# EAGLE design sensorstation_ok4 (EAGLE 6.2)
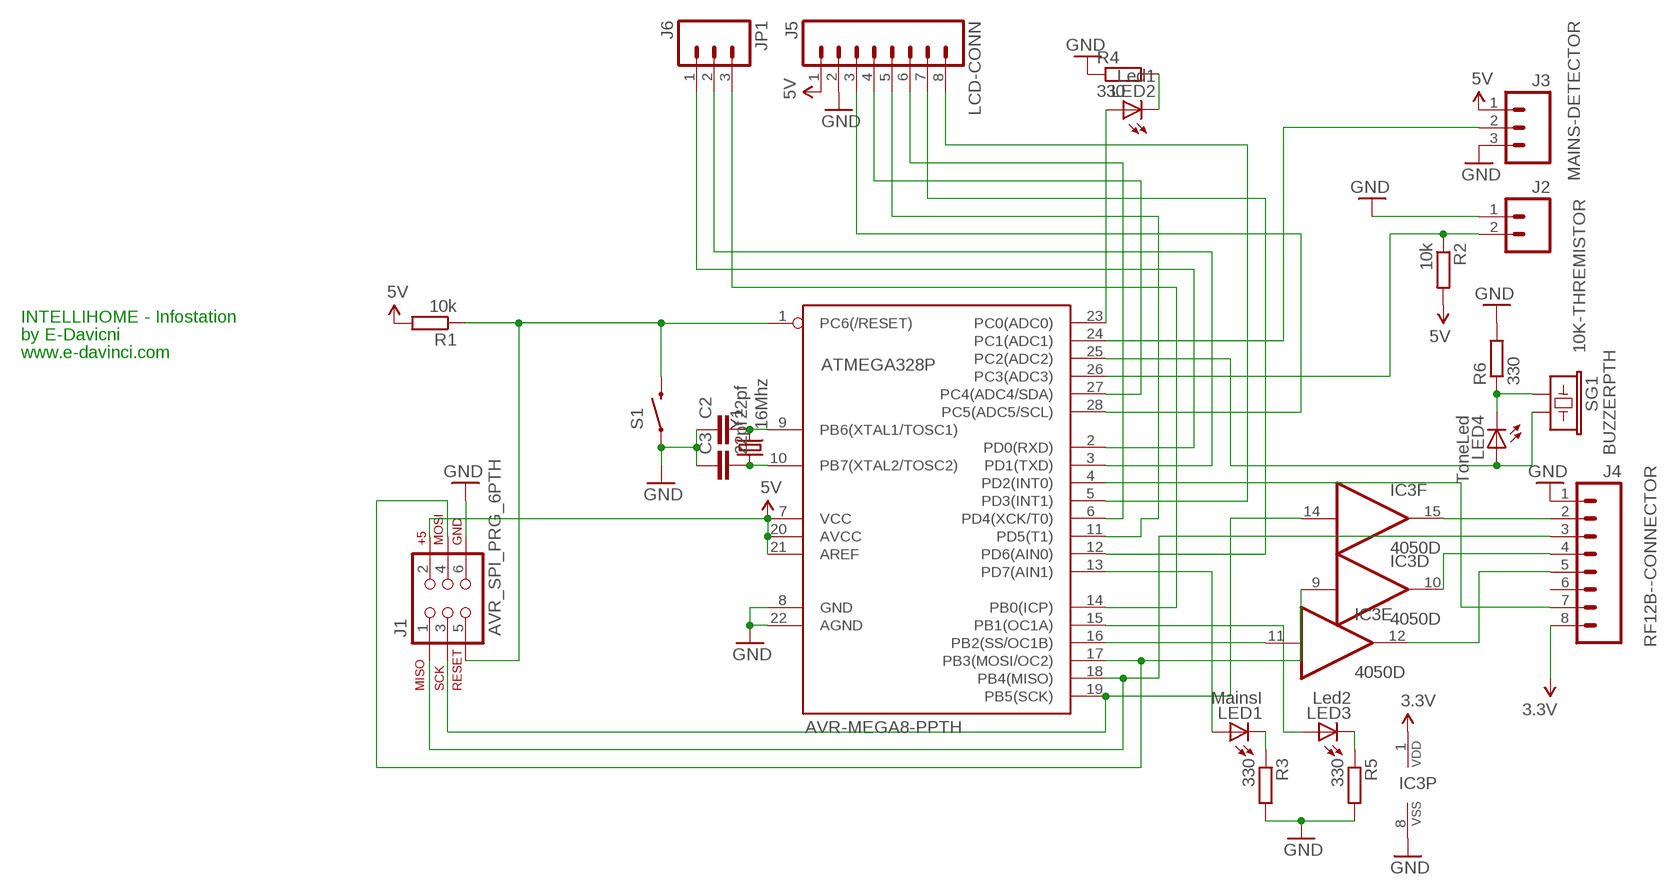
[diagram p0: schematic, sheet 1]

## Parts
10K-THREMISTOR  J2  M02PTH  [1X02]
ATMEGA328P  AVR-MEGA8-PPTH  [DIL28-3]
C2  22pf  CAPPTH  [CAP-PTH-SMALL]
C3  22pf  CAPPTH  [CAP-PTH-SMALL]
IC3  4050D  [SO16]
J1  AVR_SPI_PRG_6PTH  [2X3]
JP1  J6  M03PTH  [1X03]
LCD-CONN  J5  M081X08  [1X08]
LED1  MainsI  LED3MM  [LED3MM]
LED2  Led1  LED3MM  [LED3MM]
LED3  Led2  LED3MM  [LED3MM]
LED4  ToneLed  LED3MM  [LED3MM]
MAINS-DETECTOR  J3  M03PTH  [1X03]
R1  10k  R-EU_0207/2V  [0207/2V]
R2  10k  R-EU_0207/2V  [0207/2V]
R3  330  R-EU_0207/2V  [0207/2V]
R4  330  R-EU_0207/2V  [0207/2V]
R5  330  R-EU_0207/2V  [0207/2V]
R6  330  R-EU_0207/2V  [0207/2V]
RF12B--CONNECTOR  J4  M08LONGPADS  [1X08_LONGPADS]
S1  SWITCH-MOMENTARY-2PTH  [TACTILE-PTH]
SG1  BUZZERPTH  [BUZZER-12MM]
Y1  16Mhz  CRYSTALHC49US  [HC49US]

## Nets
3.3V: IC3.1(P:VDD) RF12B--CONNECTOR.8
5V: ATMEGA328P.7(VCC) ATMEGA328P.20(AVCC) ATMEGA328P.21(AREF) J1.2 LCD-CONN.1 MAINS-DETECTOR.1 R1.2 R2.2
GND: 10K-THREMISTOR.1 ATMEGA328P.8(GND) ATMEGA328P.22(AGND) C2.1 C3.1 IC3.8(P:VSS) J1.6 LCD-CONN.2 MAINS-DETECTOR.3 R3.2 R4.1 R5.2 R6.2 RF12B--CONNECTOR.1 S1.1
N$1: ATMEGA328P.4(PD2(INT0)) RF12B--CONNECTOR.7
N$2: ATMEGA328P.16(PB2(SS/OC1B)) IC3.11(E:I)
N$3: ATMEGA328P.19(PB5(SCK)) IC3.14(F:I) J1.3
N$4: ATMEGA328P.17(PB3(MOSI/OC2)) IC3.9(D:I) J1.4
N$5: IC3.10(D:O) RF12B--CONNECTOR.4
N$6: ATMEGA328P.9(PB6(XTAL1/TOSC1)) C2.2 Y1.2
N$7: ATMEGA328P.10(PB7(XTAL2/TOSC2)) C3.2 Y1.1
N$8: ATMEGA328P.24(PC1(ADC1)) MAINS-DETECTOR.2
N$9: 10K-THREMISTOR.2 ATMEGA328P.26(PC3(ADC3)) R2.1
N$10: LED1.K(C) R3.1
N$11: LED4.K(C) R6.1 SG1.+
N$12: LED2.K(C) R4.2
N$13: LED3.K(C) R5.1
N$14: ATMEGA328P.23(PC0(ADC0)) LED2.A
N$15: ATMEGA328P.15(PB1(OC1A)) LED3.A
N$16: ATMEGA328P.25(PC2(ADC2)) LED4.A SG1.-
N$17: ATMEGA328P.14(PB0(ICP)) JP1.3
N$18: IC3.15(F:O) RF12B--CONNECTOR.2
N$20: IC3.12(E:O) RF12B--CONNECTOR.5
N$22: ATMEGA328P.13(PD7(AIN1)) LED1.A
N$23: ATMEGA328P.18(PB4(MISO)) J1.1 RF12B--CONNECTOR.3
N$24: ATMEGA328P.12(PD6(AIN0)) LCD-CONN.7
N$25: ATMEGA328P.11(PD5(T1)) LCD-CONN.5
N$26: ATMEGA328P.6(PD4(XCK/T0)) LCD-CONN.6
N$27: ATMEGA328P.5(PD3(INT1)) LCD-CONN.8
N$28: ATMEGA328P.3(PD1(TXD)) JP1.2
N$29: ATMEGA328P.2(PD0(RXD)) JP1.1
N$30: ATMEGA328P.27(PC4(ADC4/SDA)) LCD-CONN.4
N$31: ATMEGA328P.28(PC5(ADC5/SCL)) LCD-CONN.3
N$34: ATMEGA328P.1(PC6(/RESET)) J1.5 R1.1 S1.3
Unconnected: IC3.2(A:O) IC3.3(A:I) IC3.4(B:O) IC3.5(B:I) IC3.6(C:O) IC3.7(C:I) RF12B--CONNECTOR.6

## Notes on the sheet
- INTELLIHOME - Infostation
- by E-Davicni
- www.e-davinci.com

## Library data of the parts
10K-THREMISTOR = SparkFun:M02: Header 2 Standard 2-pin 0.1" header. Use with straight break away headers (SKU : PRT-00116), right angle break away headers (PRT-00553), swiss pins (PRT-00743), machine pins (PRT-00117), and female headers (PRT-00115). Molex polarized connector foot print use with SKU : PRT-08233 with associated crimp pins and housings.
ATMEGA328P = SparkFun:AVR-MEGA8-P: MICROCONTROLLER 8 Kbytes FLASH 1 kbytes SRAM 512 bytes EEPROM USART 4-channel 10 bit ADC 2-channel 8 bit ADC
C2 C3 = SparkFun:CAP: Capacitor Standard 0603 ceramic capacitor, and 0.1" leaded capacitor.
IC3 = 40xx:4050: Hex non-inverting BUFFER
J1 = SparkFun:AVR_SPI_PRG_6: AVR ISP 6 Pin This is the reduced ISP connector for AVR programming. Common on Arduino. This footprint will take up less PCB space and can be used with a 10-pin to 6-pin adapter such as SKU: BOB-08508
JP1 MAINS-DETECTOR = SparkFun:M03: Header 3 Standard 3-pin 0.1" header. Use with straight break away headers (SKU : PRT-00116), right angle break away headers (PRT-00553), swiss pins (PRT-00743), machine pins (PRT-00117), and female headers (PRT-00115). Molex polarized connector foot print use with SKU : PRT-08232 with associated crimp pins and housings.
LCD-CONN RF12B--CONNECTOR = SparkFun:M08: Header 8 Standard 8-pin 0.1" header. Use with straight break away headers (SKU : PRT-00116), right angle break away headers (PRT-00553), swiss pins (PRT-00743), machine pins (PRT-00117), and female headers (PRT-00115).
LED1-LED4 = SparkFun:LED: LEDs Standard schematic elements and footprints for 5mm, 3mm, 1206, and 0603 sized LEDs. 5mm - Spark Fun Electronics SKU : COM-00529 (and others)
R1-R6 = resistor:R-EU_: RESISTOR, European symbol
S1 = SparkFun:SWITCH-MOMENTARY-2
SG1 = SparkFun:BUZZER: Buzzer 12mm Spark Fun Electronics SKU : Comp-Buzzer
Y1 = SparkFun:CRYSTAL: Crystals Various standard crystals. Proven footprints. Spark Fun Electronics SKU : COM-00534

## Board
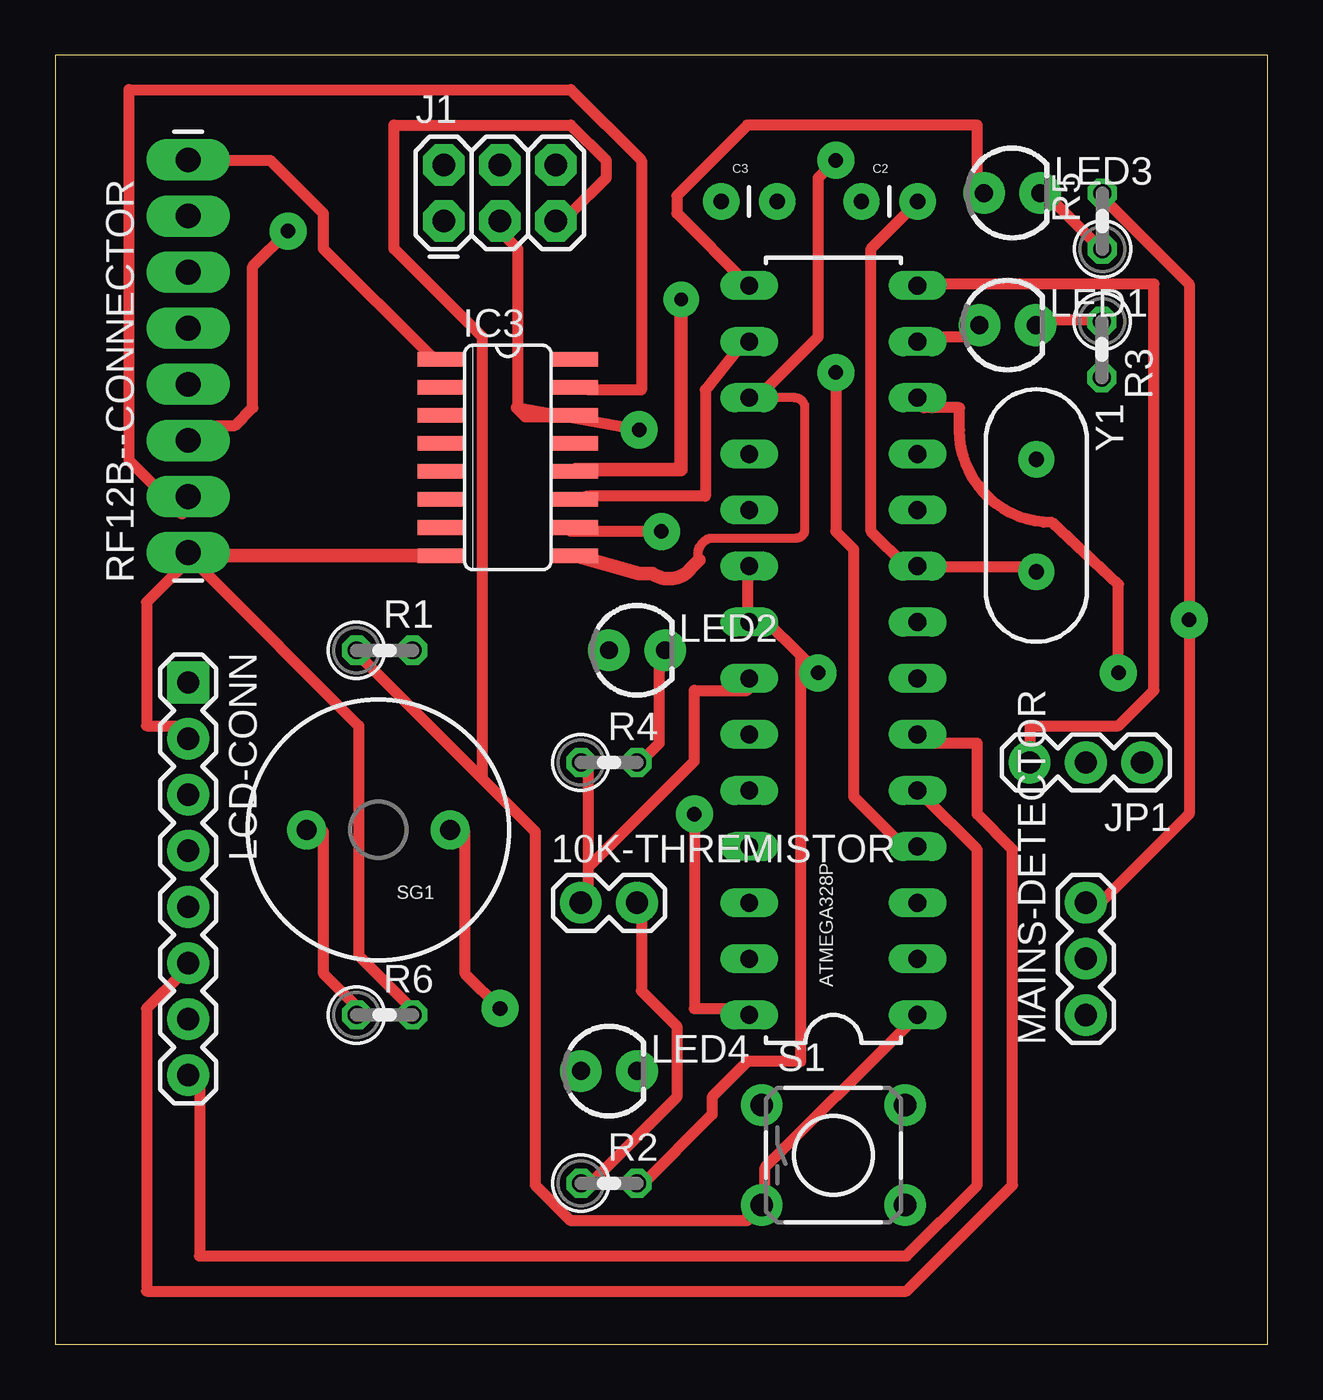
[diagram p1: board, top side]
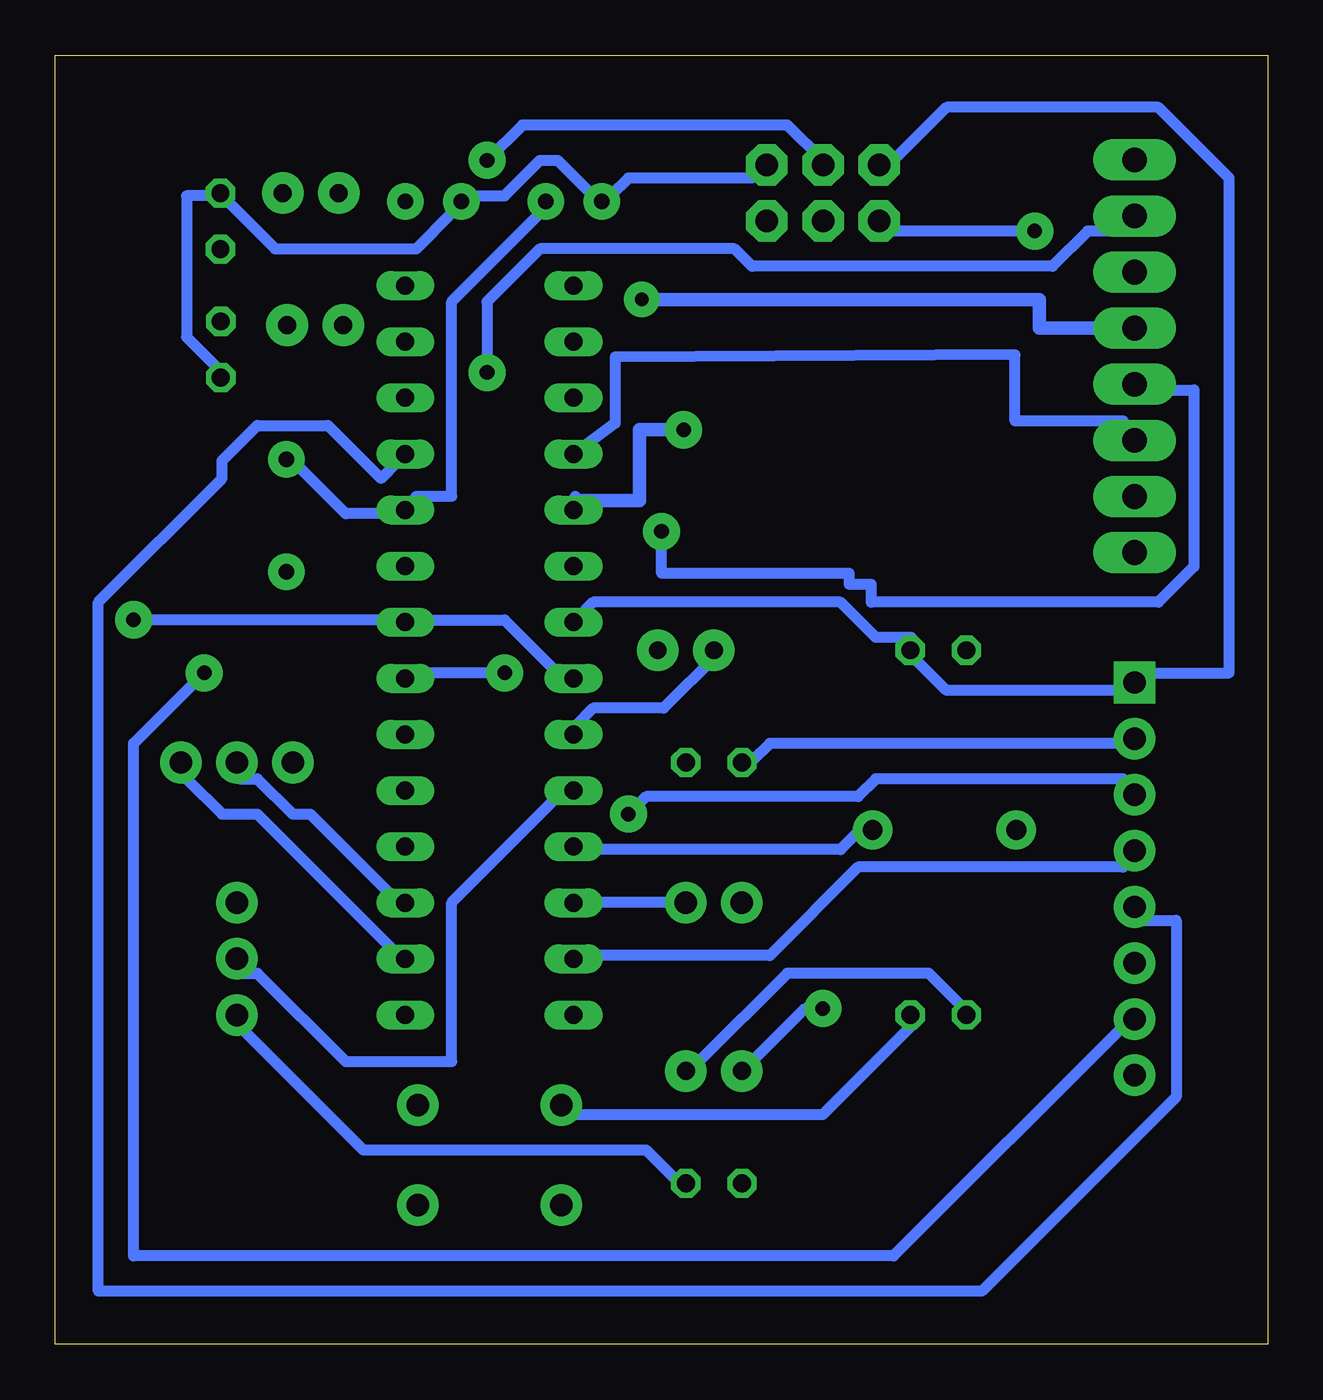
[diagram p2: board, bottom side, seen from below]

Size 54.89 x 58.36 mm. Coordinates in mm from the lower left corner, seen from the top.
Outline: 0,0 54.89,0 54.89,58.36 0,58.36 0,0
Copper layers (1*16): Top 0.035mm / dielectric 1.5mm / Bottom 0.035mm
Design rules: minimum track width 20mil, minimum drill 26mil, track to track 13mil, track to pad 16mil, pad to pad 16mil, via to via 16mil, smd to smd 8mil, copper to edge 30mil, drill to drill 8mil, minimum pad ring 10mil, minimum via ring 20mil, stop-mask expansion 4mil, vias tented up to drill 0mil, thermal gap 10mil

### Footprints (pad centres in the part's own frame; a part is rotated, then mirrored left to right if it is on the bottom)
1X02 = drill 1.016 pad 1.88: 1 0,0; 2 2.54,0
DIL28-3 = drill 0.813 long: 1 -16.51,-3.81; 2 -13.97,-3.81; 3 -11.43,-3.81; 4 -8.89,-3.81; 5 -6.35,-3.81; 6 -3.81,-3.81; 7 -1.27,-3.81; 8 1.27,-3.81; 9 3.81,-3.81; 10 6.35,-3.81; 11 8.89,-3.81; 12 11.43,-3.81; 13 13.97,-3.81; 14 16.51,-3.81; 15 16.51,3.81; 16 13.97,3.81; 17 11.43,3.81; 18 8.89,3.81; 19 6.35,3.81; 20 3.81,3.81; 21 1.27,3.81; 22 -1.27,3.81; 23 -3.81,3.81; 24 -6.35,3.81; 25 -8.89,3.81; 26 -11.43,3.81; 27 -13.97,3.81; 28 -16.51,3.81
CAP-PTH-SMALL = drill 0.7 pad 1.651: 1 0,0; 2 2.54,0
SO16 = smd 0.66 x 2.032: 1 -4.445,-3.073; 2 -3.175,-3.073; 3 -1.905,-3.073; 4 -0.635,-3.073; 5 0.635,-3.073; 6 1.905,-3.073; 7 3.175,-3.073; 8 4.445,-3.073; 9 4.445,3.073; 10 3.175,3.073; 11 1.905,3.073; 12 0.635,3.073; 13 -0.635,3.073; 14 -1.905,3.073; 15 -3.175,3.073; 16 -4.445,3.073
2X3 = drill 1.016 pad 1.88 octagon: 1 0,0; 2 0,2.54; 3 2.54,0; 4 2.54,2.54; 5 5.08,0; 6 5.08,2.54
1X03 = drill 1.016 pad 1.88: 1 0,0; 2 2.54,0; 3 5.08,0
1X08 = drill 1.016 pad 1.88 square: 1 0,0 | drill 1.016 pad 1.88: 2 2.54,0; 3 5.08,0; 4 7.62,0; 5 10.16,0; 6 12.7,0; 7 15.24,0; 8 17.78,0
LED3MM = drill 0.813 pad 1.88: A -1.27,0; K 1.27,0
0207/2V = drill 0.813 octagon: 1 -1.27,0; 2 1.27,0
1X08_LONGPADS = drill 1.118 pad 1.88 long: 1 0,0; 2 2.54,0; 3 5.08,0; 4 7.62,0; 5 10.16,0; 6 12.7,0; 7 15.24,0; 8 17.78,0
TACTILE-PTH = drill 1.016 pad 1.88: 1 -3.251,2.261; 2 3.251,2.261; 3 -3.251,-2.261; 4 3.251,-2.261
BUZZER-12MM = drill 0.9 pad 1.778: + 3.25,0; - -3.25,0
HC49US = drill 0.7 pad 1.651: 1 -2.54,0; 2 2.54,0

### Placement (x,y rotation side)
10K-THREMISTOR  23.8,19.99 0 top
ATMEGA328P  35.23,31.42 90 top
C2  36.5,51.74 0 top
C3  30.15,51.74 0 top
IC3  20.49,40.15 270 top
J1  17.59,50.85 0 top
JP1  49.2,26.34 180 top
LCD-CONN  6.02,29.96 270 top
LED1  43.12,46.14 0 top
LED2  26.34,31.42 0 top
LED3  43.32,52.12 0 top
LED4  25.07,12.37 0 top
MAINS-DETECTOR  46.66,14.91 90 top
R1  14.91,31.42 0 top
R2  25.07,7.29 0 top
R3  47.39,45.04 270 top
R4  25.07,26.34 0 top
R5  47.41,50.85 90 top
R6  14.91,14.91 0 top
RF12B--CONNECTOR  6.02,35.84 90 top
S1  35.23,8.56 0 top
SG1  14.63,23.29 180 top
Y1  44.42,37.52 270 top

### Tracks (layer width: path | path; a pad name or v marks a point on that pad's centre or on a via)
3.3V
  Top 0.508: IC3.1 16.94,44.8 12.14,49.6 12.14,51.2 9.74,53.6 6.54,53.6 RF12B--CONNECTOR.8
5V  (via drill 0.66)
  Top 0.508: ATMEGA328P.20 31.34,35.2 31.34,32.8 ATMEGA328P.21 32.14,32.8 33.74,31.2 | 33.74,31.2 v34.54,30.4 | 33.74,31.2 33.74,12.8 31.34,12.8 29.74,11.2 29.74,10.4 26.54,7.2 R2.2
  Bottom 0.508: R2.2 26.54,7.2 28.14,8.8 40.94,8.8 46.54,14.4 MAINS-DETECTOR.1 | v34.54,30.4 38.54,30.4 ATMEGA328P.7 | J1.2 16.94,53.6 14.54,56 4.94,56 1.74,52.8 1.74,30.4 5.74,30.4 LCD-CONN.1 6.54,29.6 14.54,29.6 16.14,31.2 R1.2 16.14,32 17.74,32 19.34,33.6 30.54,33.6 31.34,32.8 ATMEGA328P.21
GND  (via drill 0.66)
  Top 0.508: 24.14,21.6 24.14,20 10K-THREMISTOR.1 | 24.14,21.6 24.14,26.4 R4.1 | LCD-CONN.2 5.74,28 4.14,28 4.14,33.6 5.74,35.2 RF12B--CONNECTOR.1 6.54,35.2 13.74,28 13.74,17.6 16.14,15.2 R6.2 | 24.14,21.6 28.94,26.4 28.94,29.6 31.34,29.6 ATMEGA328P.22 | MAINS-DETECTOR.3 47.34,20 51.34,24 v51.34,32.8 51.34,48 47.34,52 R5.2
  Top 0.61: IC3.8 6.24,35.7 5.74,35.2
  Bottom 0.508: R6.2 16.14,14.4 20.14,10.4 31.34,10.4 S1.1 | ATMEGA328P.22 32.14,30.4 34.54,32.8 38.54,32.8 ATMEGA328P.8 39.34,32.8 v51.34,32.8 | R4.1 23.34,26.4 22.54,27.2 6.54,27.2 LCD-CONN.2 | J1.6 23.34,52.8 28.94,52.8 29.74,52 C3.1 30.54,52 32.14,53.6 32.94,53.6 34.54,52 36.14,52 C2.1 36.94,51.2 38.54,49.6 44.94,49.6 47.34,52 | 47.34,52 48.94,52 48.94,45.6 47.34,44 R3.2 | 47.34,52 R5.2
N$1  (via drill 0.66)
  Top 0.508: v35.34,44 35.34,36.8 36.14,36 36.14,24.8 38.54,22.4 ATMEGA328P.4
  Bottom 0.508: v35.34,44 35.34,47.2 32.94,49.6 24.14,49.6 23.34,48.8 9.74,48.8 8.14,50.4 6.54,50.4 RF12B--CONNECTOR.7
N$2
  Top 0.508: IC3.11 24.14,38.4 29.44,38.4 29.44,43.2 31.34,45.6 ATMEGA328P.16
N$3  (via drill 0.66)
  Top 0.508: v26.44,41.4 20.94,42.4 20.94,49.6 20.14,50.4 J1.3
  Top 0.61: IC3.14 21.29,42.05 20.94,42.4
  Bottom 0.508: 31.34,38.4 ATMEGA328P.19
  Bottom 0.61: v26.44,41.4 28.44,41.4 28.44,38.2 31.42,38.2 ATMEGA328P.19
N$4  (via drill 0.66)
  Top 0.406: 29.14,35.5 arc-90 29.64,36.5 33.54,36.5 arc90 33.94,36.9 33.94,42.4 arc90 33.49,42.85 ATMEGA328P.17
  Top 0.508: v35.34,53.6 34.54,52.8 34.54,45.6 32.14,43.2 ATMEGA328P.17
  Top 0.61: IC3.9 26.44,34.9 27.04,34.9 arc90 28.85,35.2 29.14,35.5
  Bottom 0.508: v35.34,53.6 33.74,55.2 21.74,55.2 20.14,53.6 J1.4
N$5  (via drill 0.66)
  Top 0.508: v27.44,36.8 23.34,36.8 IC3.10
  Bottom 0.508: v27.44,36.8 27.44,34.9 18.94,34.9 18.94,34.4 17.94,34.4 17.94,33.6 4.94,33.6 3.34,35.2 3.34,43.2 5.74,43.2 RF12B--CONNECTOR.4
N$6
  Top 0.508: C2.2 38.54,51.2 36.94,49.6 36.94,36.8 38.54,35.2 ATMEGA328P.9 39.34,35.2 44.14,35.2 Y1.2
N$7
  Bottom 0.508: C3.2 32.94,51.2 36.94,47.2 36.94,38.4 38.54,38.4 ATMEGA328P.10 39.34,37.6 41.74,37.6 44.14,40 Y1.1
N$8
  Bottom 0.508: ATMEGA328P.24 32.14,24.8 36.94,20 36.94,12.8 41.74,12.8 45.74,16.8 46.54,16.8 MAINS-DETECTOR.2
N$9
  Top 0.508: R2.1 24.14,7.2 28.14,11.2 28.14,14.4 26.54,16 26.54,19.2 10K-THREMISTOR.2
  Bottom 0.508: ATMEGA328P.26 31.34,20 26.54,20 10K-THREMISTOR.2
N$10
  Top 0.508: R3.1 47.34,46.4 44.94,46.4 LED1.K
N$11
  Top 0.508: R6.1 13.74,15.2 12.14,16.8 12.14,23.2 SG1.+
  Bottom 0.508: LED4.K 25.74,12.8 21.74,16.8 15.34,16.8 13.74,15.2 R6.1
N$12
  Top 0.508: R4.2 26.54,26.4 27.34,27.2 27.34,31.2 LED2.K
N$13
  Top 0.508: R5.1 47.34,49.6 44.94,52 LED3.K
N$14
  Bottom 0.508: ATMEGA328P.23 31.34,28 30.54,28.8 27.34,28.8 24.94,31.2 LED2.A
N$15
  Top 0.508: ATMEGA328P.15 31.34,48 28.14,51.2 28.14,52 31.34,55.2 41.74,55.2 41.74,52.8 LED3.A
N$16  (via drill 0.66)
  Top 0.508: v20.14,15.2 18.54,16.8 18.54,23.2 SG1.-
  Bottom 0.508: ATMEGA328P.25 31.34,22.4 19.34,22.4 18.54,23.2 SG1.- | v20.14,15.2 20.94,15.2 23.34,12.8 LED4.A
N$17
  Top 0.508: ATMEGA328P.14 39.34,48 49.74,48 49.74,29.6 48.14,28 44.14,28 44.14,26.4 JP1.3
N$18
  Top 0.508: IC3.15 24.14,43.2 26.54,43.2 26.54,53.6 23.34,56.8 3.34,56.8 3.34,40 5.74,37.6 RF12B--CONNECTOR.2
N$20  (via drill 0.6)
  Top 0.61: v28.34,47.3 28.34,39.6 23.56,39.6 IC3.12
  Bottom 0.61: RF12B--CONNECTOR.5 10.34,46 10.34,47.3 v28.34,47.3
N$22
  Top 0.508: ATMEGA328P.13 39.34,45.6 41.74,45.6 LED1.A
N$23  (via drill 0.66)
  Top 0.508: v10.54,50.4 8.94,48.8 8.94,42.4 8.14,41.6 6.54,41.6 RF12B--CONNECTOR.3
  Bottom 0.508: ATMEGA328P.18 29.54,41.7 29.54,44.7 11.44,44.8 11.44,41.8 6.54,41.8 RF12B--CONNECTOR.3 | v10.54,50.4 16.94,50.4 J1.1
N$24  (via drill 0.66)
  Top 0.508: v48.14,30.4 48.14,34.4 45.14,37.2 arc-90 40.94,41.4 40.94,42.4 39.34,42.4 ATMEGA328P.12
  Bottom 0.508: v48.14,30.4 51.34,27.2 51.34,4 16.94,4 6.54,14.4 LCD-CONN.7
N$25
  Bottom 0.508: LCD-CONN.5 5.74,19.2 4.14,19.2 4.14,11.2 12.94,2.4 52.94,2.4 52.94,33.6 47.34,39.2 47.34,40 45.74,41.6 42.54,41.6 40.14,39.2 39.34,40 ATMEGA328P.11
N$26
  Top 0.508: ATMEGA328P.6 39.34,27.2 41.74,27.2 41.74,24 43.34,22.4 43.34,7.2 38.54,2.4 4.14,2.4 4.14,15.2 5.74,16.8 LCD-CONN.6
N$27
  Top 0.508: ATMEGA328P.5 39.34,24.8 41.74,22.4 41.74,7.2 38.54,4 6.54,4 6.54,12 LCD-CONN.8
N$28
  Bottom 0.508: ATMEGA328P.3 39.34,20 43.34,24 44.14,24 45.74,25.6 46.54,25.6 JP1.2
N$29
  Bottom 0.508: ATMEGA328P.2 39.34,17.6 45.74,24 47.34,24 48.94,25.6 JP1.1
N$30
  Bottom 0.508: ATMEGA328P.27 31.34,17.6 22.54,17.6 18.54,21.6 6.54,21.6 LCD-CONN.4
N$31  (via drill 0.66)
  Top 0.508: v28.94,24 28.94,15.2 31.34,15.2 ATMEGA328P.28
  Bottom 0.508: v28.94,24 28.14,24.8 18.54,24.8 17.74,25.6 6.54,25.6 LCD-CONN.3
N$34
  Top 0.508: 19.34,25.6 21.74,23.2 21.74,7.2 23.34,5.6 31.34,5.6 31.34,6.4 S1.3 32.14,6.4 32.14,8 38.54,14.4 ATMEGA328P.1 | 19.34,25.6 13.74,31.2 R1.1 | 19.34,25.6 19.34,45.6 15.34,49.6 15.34,55.2 23.34,55.2 24.94,53.6 24.94,52.8 23.34,51.2 J1.5